# Altium schematic sheet E103-W02.SchDoc
size A2
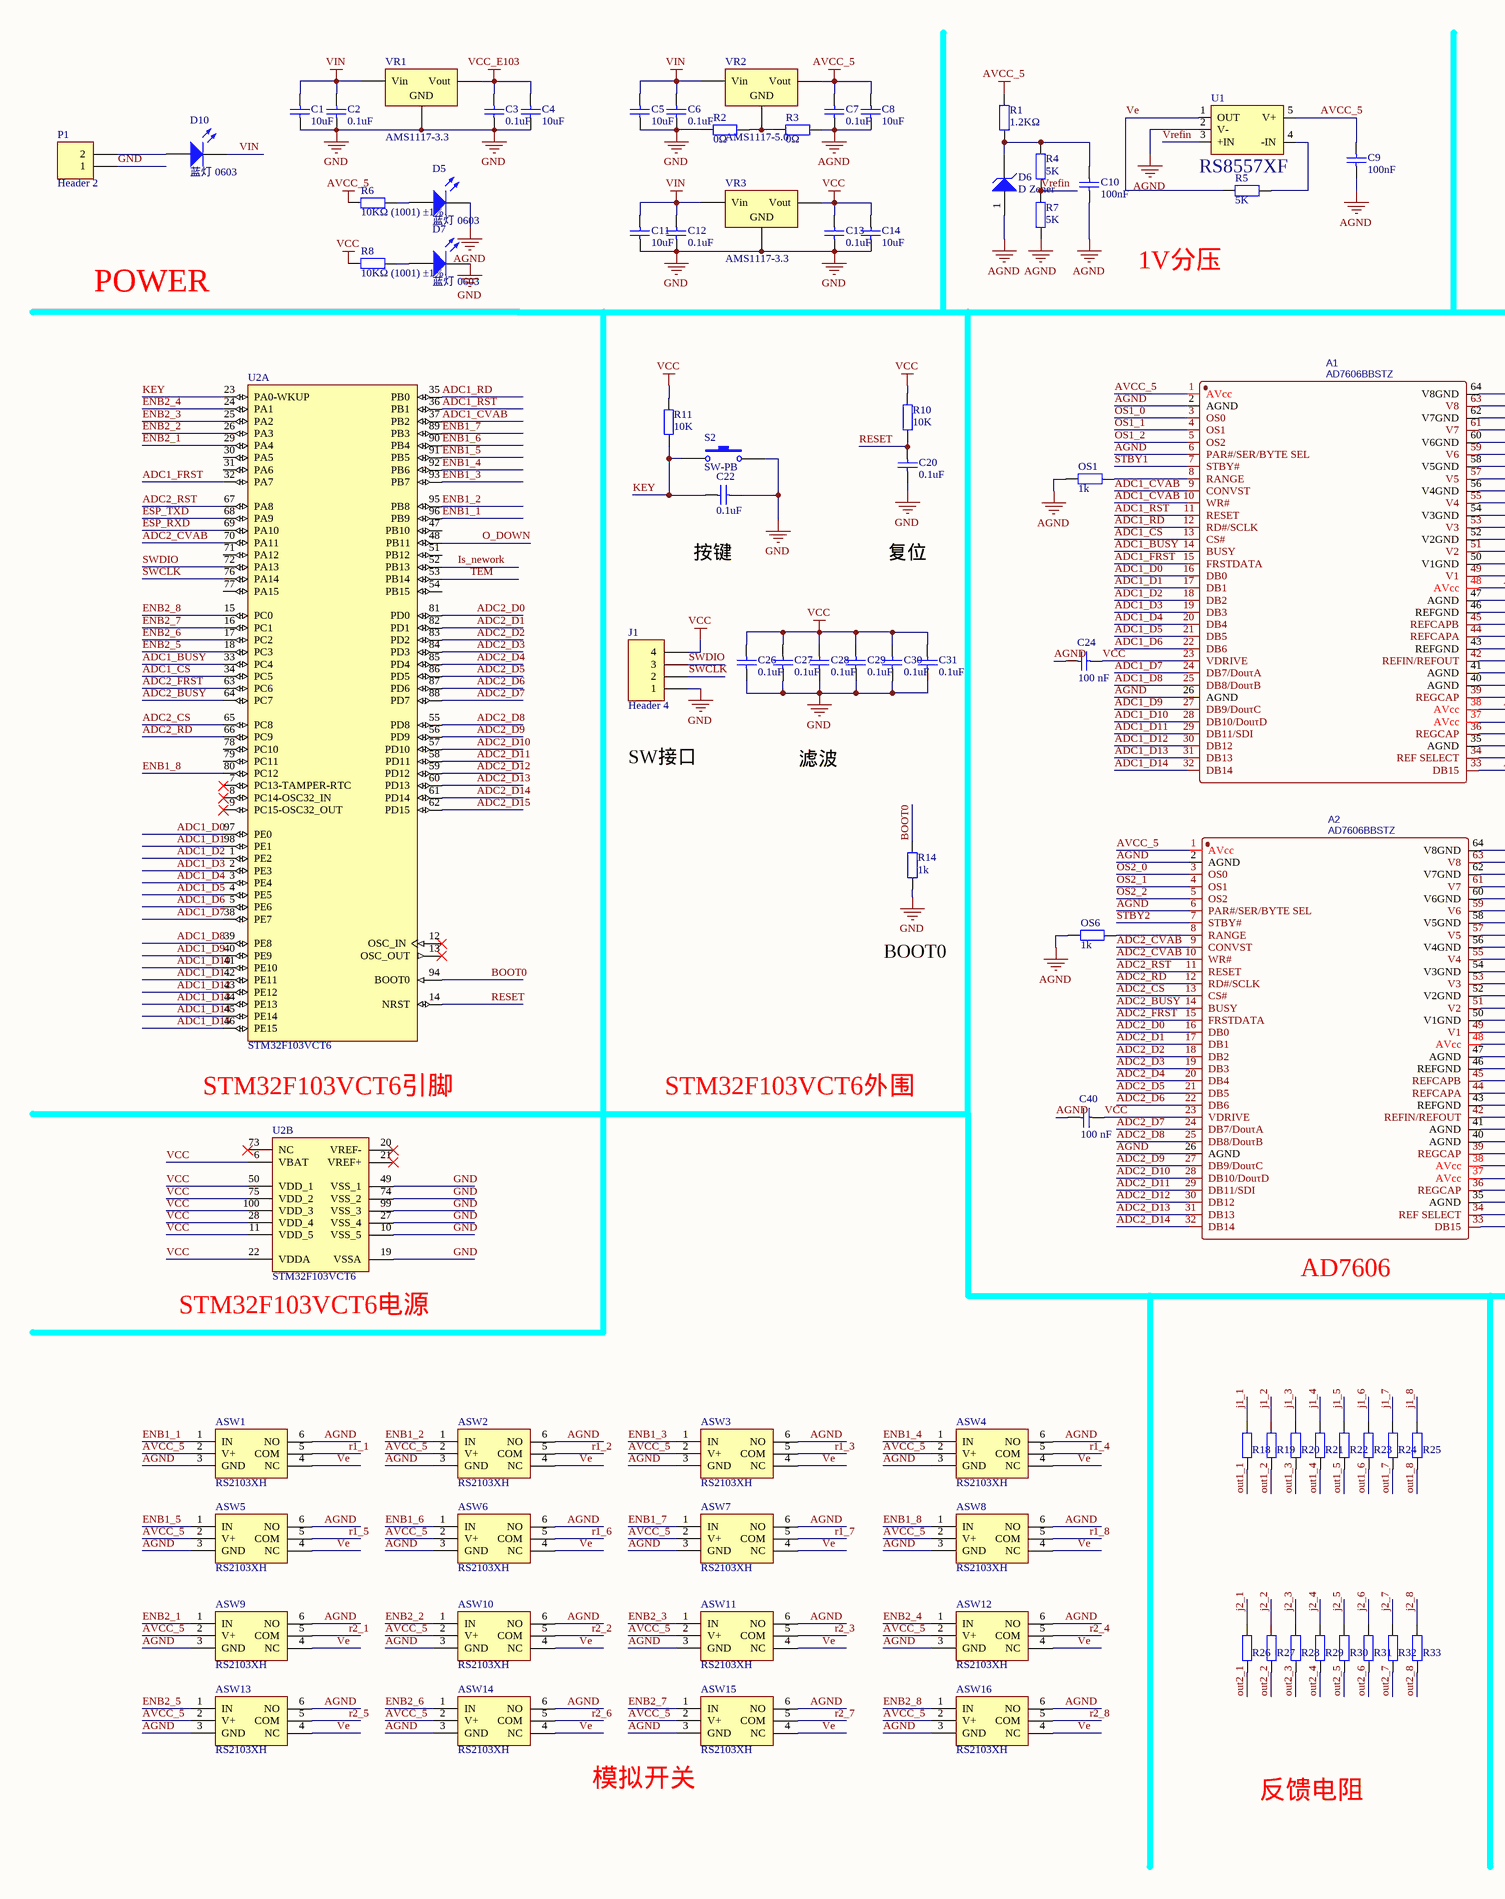
[diagram p0: E103-W02.SchDoc, left]
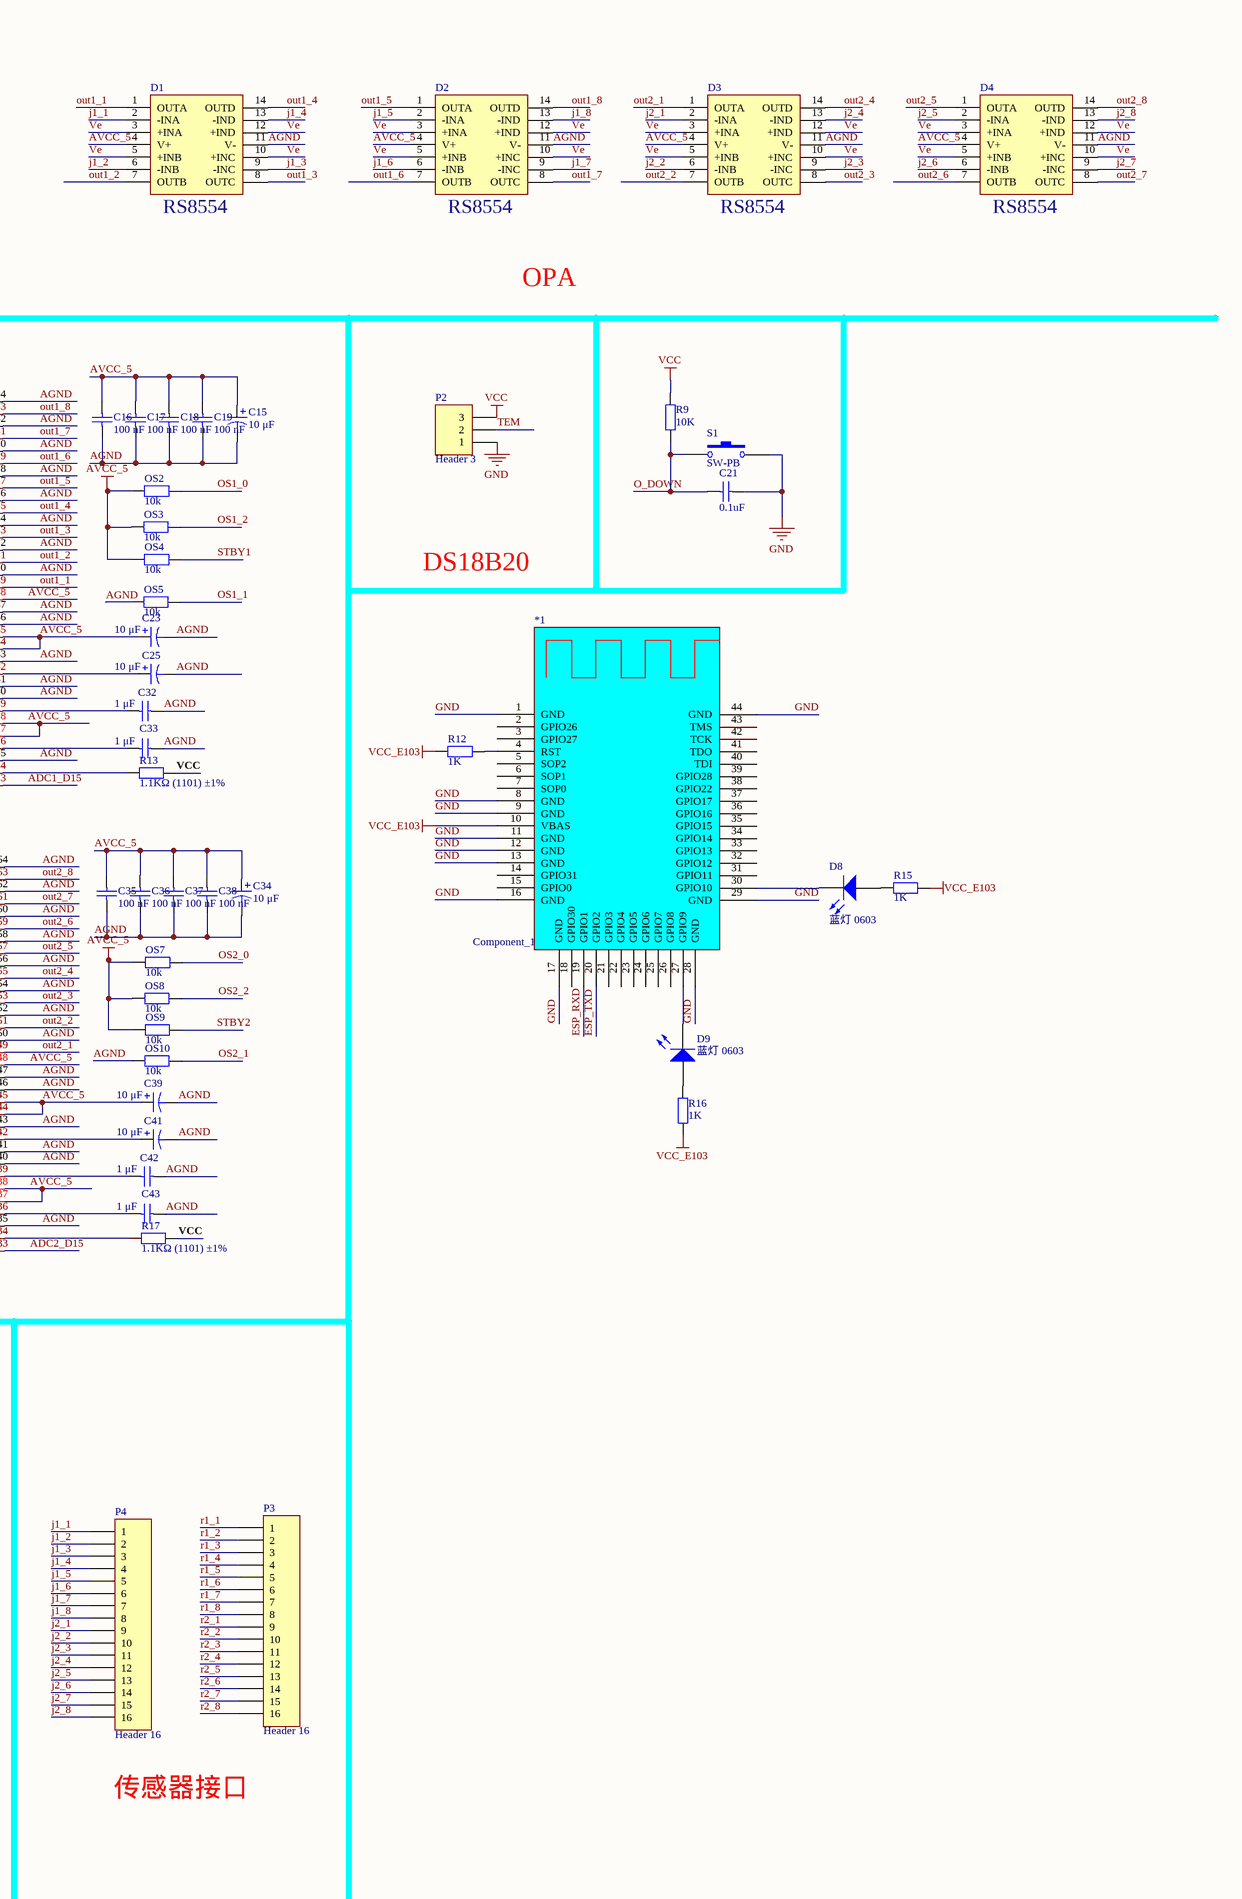
[diagram p1: E103-W02.SchDoc, right]

## Parts
*1  Component_1  [E103-W02]
A1  AD7606BBSTZ  [AD7606]
A2  AD7606BBSTZ  [AD7606]
ASW1  RS2103XH  [SOT-23-6]
ASW2  RS2103XH  [SOT-23-6]
ASW3  RS2103XH  [SOT-23-6]
ASW4  RS2103XH  [SOT-23-6]
ASW5  RS2103XH  [SOT-23-6]
ASW6  RS2103XH  [SOT-23-6]
ASW7  RS2103XH  [SOT-23-6]
ASW8  RS2103XH  [SOT-23-6]
ASW9  RS2103XH  [SOT-23-6]
ASW10  RS2103XH  [SOT-23-6]
ASW11  RS2103XH  [SOT-23-6]
ASW12  RS2103XH  [SOT-23-6]
ASW13  RS2103XH  [SOT-23-6]
ASW14  RS2103XH  [SOT-23-6]
ASW15  RS2103XH  [SOT-23-6]
ASW16  RS2103XH  [SOT-23-6]
C1  10uF  [0603_C]
C2  0.1uF  [0603_C]
C3  0.1uF  [0603_C]
C4  10uF  [0603_C]
C5  10uF  [0603_C]
C6  0.1uF  [0603_C]
C7  0.1uF  [0603_C]
C8  10uF  [0603_C]
C9  100nF  [0603_C]
C10  100nF  [0603_C]
C11  10uF  [0603_C]
C12  0.1uF  [0603_C]
C13  0.1uF  [0603_C]
C14  10uF  [0603_C]
C15  value 10 μF  [CASE-A_3216]  (hidden comment: Cap Pol3)
C16  100 nF  [0603_C]
C17  100 nF  [0603_C]
C18  100 nF  [0603_C]
C19  100 nF  [0603_C]
C20  0.1uF  [0603_C]
C21  0.1uF  [0603_C]
C22  0.1uF  [0603_C]
C23  value 10 μF  [CASE-A_3216]  (hidden comment: Cap Pol3)
C24  100 nF  [0603_C]
C25  value 10 μF  [CASE-A_3216]  (hidden comment: Cap Pol3)
C26  0.1uF  [0603_C]
C27  0.1uF  [0603_C]
C28  0.1uF  [0603_C]
C29  0.1uF  [0603_C]
C30  0.1uF  [0603_C]
C31  0.1uF  [0603_C]
C32  1 μF  [0603_C]
C33  1 μF  [0603_C]
C34  value 10 μF  [CASE-A_3216]  (hidden comment: Cap Pol3)
C35  100 nF  [0603_C]
C36  100 nF  [0603_C]
C37  100 nF  [0603_C]
C38  100 nF  [0603_C]
C39  value 10 μF  [CASE-A_3216]  (hidden comment: Cap Pol3)
C40  100 nF  [0603_C]
C41  value 10 μF  [CASE-A_3216]  (hidden comment: Cap Pol3)
C42  1 μF  [0603_C]
C43  1 μF  [0603_C]
D1  RS8554  [RS8554]
D2  RS8554  [RS8554]
D3  RS8554  [RS8554]
D4  RS8554  [RS8554]
D5  蓝灯 0603  [0603_LED_S1]
D6  D Zener  [SOT-23(SOT-23-3)]
D7  蓝灯 0603  [0603_LED_S1]
D8  蓝灯 0603  [0603_LED_S1]
D9  蓝灯 0603  [0603_LED_S1]
D10  蓝灯 0603  [标准DO-214AC]
J1  Header 4  [HDR1X4]
OS1  1k  [0603_C]
OS2  10k  [0603_C]
OS3  10k  [0603_C]
OS4  10k  [0603_C]
OS5  10k  [0603_C]
OS6  1k  [0603_C]
OS7  10k  [0603_C]
OS8  10k  [0603_C]
OS9  10k  [0603_C]
OS10  10k  [0603_C]
P1  Header 2  [HDR1X2]
P2  Header 3  [HDR1X3]
P3  Header 16  [FPC_16_0.5]
P4  Header 16  [FPC_16_0.5]
R1  1.2KΩ  [0603_R]
R2  0Ω  [0603_R]
R3  0Ω  [0603_R]
R4  5K  [0603_R]
R5  5K  [0603_R]
R6  10KΩ (1001) ±1%  [0603_R]
R7  5K  [0603_R]
R8  10KΩ (1001) ±1%  [0603_R]
R9  10K  [0603_R]
R10  10K  [0603_R]
R11  10K  [0603_R]
R12  1K  [0603_C]
R13  1.1KΩ (1101) ±1%  [0603_C]
R14  1k  [0603_R]
R15  1K  [0603_R]
R16  1K  [0603_R]
R17  1.1KΩ (1101) ±1%  [0603_C]
R18  100Ω  [0603_R]  (value not drawn)
R19  100Ω  [0603_R]  (value not drawn)
R20  100Ω  [0603_R]  (value not drawn)
R21  100Ω  [0603_R]  (value not drawn)
R22  100Ω  [0603_R]  (value not drawn)
R23  100Ω  [0603_R]  (value not drawn)
R24  100Ω  [0603_R]  (value not drawn)
R25  0KΩ  [0603_R]  (value not drawn)
R26  100Ω  [0603_R]  (value not drawn)
R27  100Ω  [0603_R]  (value not drawn)
R28  100Ω  [0603_R]  (value not drawn)
R29  100Ω  [0603_R]  (value not drawn)
R30  100Ω  [0603_R]  (value not drawn)
R31  100Ω  [0603_R]  (value not drawn)
R32  100Ω  [0603_R]  (value not drawn)
R33  0KΩ  [0603_R]  (value not drawn)
S1  SW-PB  [按键]
S2  SW-PB  [按键]
U1  RS8557XF  [SOT-23-5]
U2  STM32F103VCT6  [LQFP-100_14x14x05P]  (parts A,B of 2)
VR1  AMS1117-3.3  [SOT-223]
VR2  AMS1117-5.0  [SOT-223]
VR3  AMS1117-3.3  [SOT-223]

## Nets
AGND: A1.2(AGND) A1.6(PAR#/SER/BYTE_SEL) A1.26(AGND) A1.35(AGND) A1.40(AGND) A1.41(AGND) A1.43(REFGND) A1.46(REFGND) A1.47(AGND) A1.50(V1GND) A1.52(V2GND) A1.54(V3GND) A1.56(V4GND) A1.58(V5GND) A1.60(V6GND) A1.62(V7GND) A1.64(V8GND) A2.2(AGND) A2.6(PAR#/SER/BYTE_SEL) A2.26(AGND) A2.35(AGND) A2.40(AGND) A2.41(AGND) A2.43(REFGND) A2.46(REFGND) A2.47(AGND) A2.50(V1GND) A2.52(V2GND) A2.54(V3GND) A2.56(V4GND) A2.58(V5GND) A2.60(V6GND) A2.62(V7GND) A2.64(V8GND) ASW1.3(GND) ASW1.6(NO) ASW2.3(GND) ASW2.6(NO) ASW3.3(GND) ASW3.6(NO) ASW4.3(GND) ASW4.6(NO) ASW5.3(GND) ASW5.6(NO) ASW6.3(GND) ASW6.6(NO) ASW7.3(GND) ASW7.6(NO) ASW8.3(GND) ASW8.6(NO) ASW9.3(GND) ASW9.6(NO) ASW10.3(GND) ASW10.6(NO) ASW11.3(GND) ASW11.6(NO) ASW12.3(GND) ASW12.6(NO) ASW13.3(GND) ASW13.6(NO) ASW14.3(GND) ASW14.6(NO) ASW15.3(GND) ASW15.6(NO) ASW16.3(GND) ASW16.6(NO) C7.1 C8.1 C9.1 C10.1 C15.2 C16.1 C17.1 C18.1 C19.1 C23.2 C24.2 C25.2 C32.2 C33.2 C34.2 C35.1 C36.1 C37.1 C38.1 C39.2 C40.2 C41.2 C42.2 C43.2 D1.11(V-) D2.11(V-) D3.11(V-) D4.11(V-) D5.K D6.1(A) OS1.2 OS5.2 OS6.2 OS10.2 R3.2 R7.2 U1.2(V-)
AVCC_5: A1.1(AVcc) A1.37(AVcc) A1.38(AVcc) A1.44(REFCAPA) A1.45(REFCAPB) A1.48(AVcc) A2.1(AVcc) A2.37(AVcc) A2.38(AVcc) A2.44(REFCAPA) A2.45(REFCAPB) A2.48(AVcc) ASW1.2(V+) ASW2.2(V+) ASW3.2(V+) ASW4.2(V+) ASW5.2(V+) ASW6.2(V+) ASW7.2(V+) ASW8.2(V+) ASW9.2(V+) ASW10.2(V+) ASW11.2(V+) ASW12.2(V+) ASW13.2(V+) ASW14.2(V+) ASW15.2(V+) ASW16.2(V+) C7.2 C8.2 C9.2 C15.1 C16.2 C17.2 C18.2 C19.2 C23.1 C34.1 C35.2 C36.2 C37.2 C38.2 C39.1 D1.4(V+) D2.4(V+) D3.4(V+) D4.4(V+) OS2.2 OS3.2 OS4.2 OS7.2 OS8.2 OS9.2 R1.2 R6.1 U1.5(V+) VR2.2(Vout)
GND: *1.1(GND) *1.8(GND) *1.9(GND) *1.11(GND) *1.12(GND) *1.13(GND) *1.16(GND) *1.17(GND) *1.28(GND) *1.29(GND) *1.44(GND) C1.1 C2.1 C3.1 C4.1 C5.1 C6.1 C11.1 C12.1 C13.1 C14.1 C20.1 C21.1 C22.1 C26.1 C27.1 C28.1 C29.1 C30.1 C31.1 D7.K J1.1 P1.1 P2.1 R2.1 R14.1 S1.2 S2.2 U2.10(VSS_5) U2.19(VSSA) U2.27(VSS_4) U2.49(VSS_1) U2.74(VSS_2) U2.99(VSS_3) VR1.1(GND) VR3.1(GND)
VCC: A1.23(VDRIVE) A2.23(VDRIVE) C13.2 C14.2 C24.1 C26.2 C27.2 C28.2 C29.2 C30.2 C31.2 C40.1 J1.4 P2.3 R8.1 R9.2 R10.2 R11.2 R13.2 R17.2 U2.6(VBAT) U2.11(VDD_5) U2.22(VDDA) U2.28(VDD_4) U2.50(VDD_1) U2.75(VDD_2) U2.100(VDD_3) VR3.2(Vout)
VCC_E103: *1.10(VBAS) C3.2 C4.2 R12.1 R15.2 R16.1 VR1.2(Vout)
VIN: C1.2 C2.2 C5.2 C6.2 C11.2 C12.2 D10.K VR1.3(Vin) VR2.3(Vin) VR3.3(Vin)
ADC1_BUSY: A1.14(BUSY) U2.33(PC4)
ADC1_CS: A1.13(CS#) U2.34(PC5)
ADC1_CVAB: A1.9(CONVST) A1.10(WR#) U2.37(PB2)
ADC1_D0: A1.16(DB0) U2.97(PE0)
ADC1_D1: A1.17(DB1) U2.98(PE1)
ADC1_D2: A1.18(DB2) U2.1(PE2)
ADC1_D3: A1.19(DB3) U2.2(PE3)
ADC1_D4: A1.20(DB4) U2.3(PE4)
ADC1_D5: A1.21(DB5) U2.4(PE5)
ADC1_D6: A1.22(DB6) U2.5(PE6)
ADC1_D7: A1.24(DB7/DouτA) U2.38(PE7)
ADC1_D8: A1.25(DB8/DouτB) U2.39(PE8)
ADC1_D9: A1.27(DB9/DouτC) U2.40(PE9)
ADC1_D10: A1.28(DB10/DouτD) U2.41(PE10)
ADC1_D11: A1.29(DB11/SDI) U2.42(PE11)
ADC1_D12: A1.30(DB12) U2.43(PE12)
ADC1_D13: A1.31(DB13) U2.44(PE13)
ADC1_D14: A1.32(DB14) U2.45(PE14)
ADC1_D15: A1.33(DB15) U2.46(PE15)
ADC1_FRST: A1.15(FRSTDATA) U2.32(PA7)
ADC1_RD: A1.12(RD#/SCLK) U2.35(PB0)
ADC1_RST: A1.11(RESET) U2.36(PB1)
ADC2_BUSY: A2.14(BUSY) U2.64(PC7)
ADC2_CS: A2.13(CS#) U2.65(PC8)
ADC2_CVAB: A2.9(CONVST) A2.10(WR#) U2.70(PA11)
ADC2_D0: A2.16(DB0) U2.81(PD0)
ADC2_D1: A2.17(DB1) U2.82(PD1)
ADC2_D2: A2.18(DB2) U2.83(PD2)
ADC2_D3: A2.19(DB3) U2.84(PD3)
ADC2_D4: A2.20(DB4) U2.85(PD4)
ADC2_D5: A2.21(DB5) U2.86(PD5)
ADC2_D6: A2.22(DB6) U2.87(PD6)
ADC2_D7: A2.24(DB7/DouτA) U2.88(PD7)
ADC2_D8: A2.25(DB8/DouτB) U2.55(PD8)
ADC2_D9: A2.27(DB9/DouτC) U2.56(PD9)
ADC2_D10: A2.28(DB10/DouτD) U2.57(PD10)
ADC2_D11: A2.29(DB11/SDI) U2.58(PD11)
ADC2_D12: A2.30(DB12) U2.59(PD12)
ADC2_D13: A2.31(DB13) U2.60(PD13)
ADC2_D14: A2.32(DB14) U2.61(PD14)
ADC2_D15: A2.33(DB15) U2.62(PD15)
ADC2_FRST: A2.15(FRSTDATA) U2.63(PC6)
ADC2_RD: A2.12(RD#/SCLK) U2.66(PC9)
ADC2_RST: A2.11(RESET) U2.67(PA8)
BOOT0: R14.2 U2.94(BOOT0)
ENB1_1: ASW1.1(IN) U2.96(PB9)
ENB1_2: ASW2.1(IN) U2.95(PB8)
ENB1_3: ASW3.1(IN) U2.93(PB7)
ENB1_4: ASW4.1(IN) U2.92(PB6)
ENB1_5: ASW5.1(IN) U2.91(PB5)
ENB1_6: ASW6.1(IN) U2.90(PB4)
ENB1_7: ASW7.1(IN) U2.89(PB3)
ENB1_8: ASW8.1(IN) U2.80(PC12)
ENB2_1: ASW9.1(IN) U2.29(PA4)
ENB2_2: ASW10.1(IN) U2.26(PA3)
ENB2_3: ASW11.1(IN) U2.25(PA2)
ENB2_4: ASW12.1(IN) U2.24(PA1)
ENB2_5: ASW13.1(IN) U2.18(PC3)
ENB2_6: ASW14.1(IN) U2.17(PC2)
ENB2_7: ASW15.1(IN) U2.16(PC1)
ENB2_8: ASW16.1(IN) U2.15(PC0)
ESP_RXD: *1.19(GPIO1) U2.69(PA10)
ESP_TXD: *1.20(GPIO2) U2.68(PA9)
Is_nework: U2.52(PB13)
j1_1: D1.2(-INA) P4.1 R18.1
j1_2: D1.6(-INB) P4.2 R19.1
j1_3: D1.9(-INC) P4.3 R20.1
j1_4: D1.13(-IND) P4.4 R21.1
j1_5: D2.2(-INA) P4.5 R22.1
j1_6: D2.6(-INB) P4.6 R23.1
j1_7: D2.9(-INC) P4.7 R24.1
j1_8: D2.13(-IND) P4.8 R25.1
j2_1: D3.2(-INA) P4.9 R26.1
j2_2: D3.6(-INB) P4.10 R27.1
j2_3: D3.9(-INC) P4.11 R28.1
j2_4: D3.13(-IND) P4.12 R29.1
j2_5: D4.2(-INA) P4.13 R30.1
j2_6: D4.6(-INB) P4.14 R31.1
j2_7: D4.9(-INC) P4.15 R32.1
j2_8: D4.13(-IND) P4.16 R33.1
KEY: C22.2 R11.1 S2.1 U2.23(PA0-WKUP)
O_DOWN: C21.2 R9.1 S1.1 U2.48(PB11)
OS1_0: A1.3(OS0) OS2.1
OS1_1: A1.4(OS1) OS5.1
OS1_2: A1.5(OS2) OS3.1
OS2_0: A2.3(OS0) OS7.1
OS2_1: A2.4(OS1) OS10.1
OS2_2: A2.5(OS2) OS8.1
out1_1: A1.49(V1) D1.1(OUTA) R18.2
out1_2: A1.51(V2) D1.7(OUTB) R19.2
out1_3: A1.53(V3) D1.8(OUTC) R20.2
out1_4: A1.55(V4) D1.14(OUTD) R21.2
out1_5: A1.57(V5) D2.1(OUTA) R22.2
out1_6: A1.59(V6) D2.7(OUTB) R23.2
out1_7: A1.61(V7) D2.8(OUTC) R24.2
out1_8: A1.63(V8) D2.14(OUTD) R25.2
out2_1: A2.49(V1) D3.1(OUTA) R26.2
out2_2: A2.51(V2) D3.7(OUTB) R27.2
out2_3: A2.53(V3) D3.8(OUTC) R28.2
out2_4: A2.55(V4) D3.14(OUTD) R29.2
out2_5: A2.57(V5) D4.1(OUTA) R30.2
out2_6: A2.59(V6) D4.7(OUTB) R31.2
out2_7: A2.61(V7) D4.8(OUTC) R32.2
out2_8: A2.63(V8) D4.14(OUTD) R33.2
r1_1: ASW1.5(COM) P3.1
r1_2: ASW2.5(COM) P3.2
r1_3: ASW3.5(COM) P3.3
r1_4: ASW4.5(COM) P3.4
r1_5: ASW5.5(COM) P3.5
r1_6: ASW6.5(COM) P3.6
r1_7: ASW7.5(COM) P3.7
r1_8: ASW8.5(COM) P3.8
r2_1: ASW9.5(COM) P3.9
r2_2: ASW10.5(COM) P3.10
r2_3: ASW11.5(COM) P3.11
r2_4: ASW12.5(COM) P3.12
r2_5: ASW13.5(COM) P3.13
r2_6: ASW14.5(COM) P3.14
r2_7: ASW15.5(COM) P3.15
r2_8: ASW16.5(COM) P3.16
RESET: C20.2 R10.1 U2.14(NRST)
STBY1: A1.7(STBY#) OS4.1
STBY2: A2.7(STBY#) OS9.1
SWCLK: J1.2 U2.76(PA14)
SWDIO: J1.3 U2.72(PA13)
TEM: P2.2 U2.53(PB14)
Ve: ASW1.4(NC) ASW2.4(NC) ASW3.4(NC) ASW4.4(NC) ASW5.4(NC) ASW6.4(NC) ASW7.4(NC) ASW8.4(NC) ASW9.4(NC) ASW10.4(NC) ASW11.4(NC) ASW12.4(NC) ASW13.4(NC) ASW14.4(NC) ASW15.4(NC) ASW16.4(NC) D1.3(+INA) D1.5(+INB) D1.10(+INC) D1.12(+IND) D2.3(+INA) D2.5(+INB) D2.10(+INC) D2.12(+IND) D3.3(+INA) D3.5(+INB) D3.10(+INC) D3.12(+IND) D4.3(+INA) D4.5(+INB) D4.10(+INC) D4.12(+IND) R5.2 U1.1(OUT)
Vrefin: R4.1 R7.1 U1.3(+IN)
Net*1_4: *1.4(RST) R12.2
Net*1_27: *1.27(GPIO9) D9.K
Net*1_30: *1.30(GPIO10) D8.K
NetA1_8: A1.8(RANGE) OS1.1
NetA1_34: A1.34(REF_SELECT) R13.1
NetA1_36: A1.36(REGCAP) C33.1
NetA1_39: A1.39(REGCAP) C32.1
NetA1_42: A1.42(REFIN/REFOUT) C25.1
NetA2_8: A2.8(RANGE) OS6.1
NetA2_34: A2.34(REF_SELECT) R17.1
NetA2_36: A2.36(REGCAP) C43.1
NetA2_39: A2.39(REGCAP) C42.1
NetA2_42: A2.42(REFIN/REFOUT) C41.1
NetC10_2: C10.2 D6.2(K) R1.1 R4.2
NetD5_A: D5.A R6.2
NetD7_A: D7.A R8.2
NetD8_A: D8.A R15.1
NetD9_A: D9.A R16.2
NetD10_A: D10.A P1.2
NetR2_2: R2.2 R3.1 VR2.1(GND)
NetR5_1: R5.1 U1.4(-IN)

Not connected (* = marked no-connect by the designer): *1 2(GPIO26) 3(GPIO27) 5(SOP2) 6(SOP1) 7(SOP0) 14(GPIO31) 15(GPIO0) 18(GPIO30) 21(GPIO3) 22(GPIO4) 23(GPIO5) 24(GPIO6) 25(GPIO7) 26(GPIO8) 31(GPIO11) 32(GPIO12) 33(GPIO13) 34(GPIO14) 35(GPIO15) 36(GPIO16) 37(GPIO17) 38(GPIO22) 39(GPIO28) 40(TDI) 41(TDO) 42(TCK) 43(TMS); U2 7(PC13-TAMPER-RTC)* 8(PC14-OSC32_IN)* 9(PC15-OSC32_OUT)* 12(OSC_IN)* 13(OSC_OUT)* 20(VREF-)* 21(VREF+)* 30(PA5) 31(PA6) 47(PB10) 51(PB12) 54(PB15) 71(PA12) 73(NC)* 77(PA15) 78(PC10) 79(PC11)

## Notes on the sheet
- POWER
- 1V分压
- OPA
- 按键
- 复位
- DS18B20
- SW接口
- 滤波
- BOOT0
- (near U2) STM32F103VCT6引脚
- STM32F103VCT6外围
- (near U2) STM32F103VCT6电源
- (near A2) AD7606
- 模拟开关
- 反馈电阻
- 传感器接口

## Library data of the parts
A1 A2 = AD7606BBSTZ: BOM_Manufacturer: Analog Devices; Contributor: LCSC; BOM_Supplier: LCSC; BOM_Supplier Part: C443885; BOM_Manufacturer Part: AD7606BBSTZ; spicePre: U; spiceSymbolName: AD7606BBSTZ
C1-C8 C11-C14 = 0603 1.0pF (010) 0.25pF 50V: 贴片电容; ComponentLink1Description: 供应商链接; ComponentLink1URL: http://www.szlcsc.com/product/details_24709.html; Package: 0603; Supplier: LC; SuppliersPartNumber: C23969
C9 C10 C20-C22 = 0402 100nF (104) 10% 16V: 贴片电容; ComponentLink1Description: 供应商链接; ComponentLink1URL: http://www.szlcsc.com/product/details_1877.html; Package: 0402; Supplier: LC; SuppliersPartNumber: C1525
C15 C23 C25 C34 C39 C41 = Cap Pol3: Polarized Capacitor (Surface Mount); Published: 8-Jun-2000; LatestRevisionDate: 29-May-2009; LatestRevisionNote: IPC-7351 Footprint Added.; PackageReference: C0805; Publisher: Altium Limited; PackageDescription: Chip Capacitor
C16-C19 C24 C32 C33 C35-C38 C40 C42 C43 = 0603 1.5nF (152) 10% 50V: 贴片电容; ComponentLink1Description: 供应商链接; ComponentLink1URL: http://www.szlcsc.com/product/details_1947.html; Package: 0603; Supplier: LC; SuppliersPartNumber: C1595
C26-C31 = 0402 1.0uF (105) 10% 25V: 贴片电容; ComponentLink1Description: 供应商链接; ComponentLink1URL: http://www.szlcsc.com/product/details_53938.html; Package: 0402; Supplier: LC; SuppliersPartNumber: C52923
D1-D4 = 运放_OPA4374: 运放，4个集成IC，轨至轨，2.3-5.5V，SOIC-14和TSSOP-14封装
D5 D7-D10 = 0603 蓝灯: 发光二极管; ComponentLink1Description: 供应商链接; ComponentLink1URL: http://www.szlcsc.com/product/details_73150.html; Package: 0603; Supplier: LC; SuppliersPartNumber: C72041
D6 = D Zener: Zener Diode; pin to pad: 1>2 2>1; Published: 8-Jun-2000; LatestRevisionDate: 17-Jul-2002; LatestRevisionNote: Re-released for DXP Platform.; PackageReference: DIODE-0.7; Publisher: Altium Limited; PackageDescription: Diode, Thru-Hole; 2 Leads; 0.7 in Pin Spacing
J1 = Header 4: Header, 4-Pin; LatestRevisionDate: 17-Jul-2002; LatestRevisionNote: Re-released for DXP Platform.; Publisher: Altium Limited
OS1-OS10 = 0603 0Ω (0R0) 1%: 贴片电阻; ComponentLink1Description: 供应商链接; ComponentLink1URL: http://www.szlcsc.com/product/details_21903.html; Package: 0603; Supplier: LC; SuppliersPartNumber: C21189
P1 = Header 2: Header, 2-Pin; LatestRevisionDate: 17-Jul-2002; LatestRevisionNote: Re-released for DXP Platform.; Publisher: Altium Limited
P2 = Header 3: Header, 3-Pin; LatestRevisionDate: 17-Jul-2002; LatestRevisionNote: Re-released for DXP Platform.; Publisher: Altium Limited
P3 P4 = Header 16: Header, 16-Pin; LatestRevisionDate: 17-Jul-2002; LatestRevisionNote: Re-released for DXP Platform.; Publisher: Altium Limited
R1 = 0402 1.2KΩ (1201) 1%: 贴片电阻; ComponentLink1Description: 供应商链接; ComponentLink1URL: http://www.szlcsc.com/product/details_26605.html; Package: 0402; Supplier: LC; SuppliersPartNumber: C25862
R2 R3 = 1206 0Ω (0R0) 1%: 贴片电阻; ComponentLink1Description: 供应商链接; ComponentLink1URL: http://www.szlcsc.com/product/details_18576.html; Package: 1206; Supplier: LC; SuppliersPartNumber: C17888
R4 R5 R7 = 0603 100Ω (1000) 1%: 贴片电阻; ComponentLink1Description: 供应商链接; ComponentLink1URL: http://www.szlcsc.com/product/details_23502.html; Package: 0603; Supplier: LC; SuppliersPartNumber: C22775
R6 R8 = 0402 1KΩ (1001) 1%: 贴片电阻; ComponentLink1Description: 供应商链接; ComponentLink1URL: http://www.szlcsc.com/product/details_12256.html; Package: 0402; Supplier: LC; SuppliersPartNumber: C11702
R9-R11 R15 R16 = 0402 10KΩ (1002) 1%: 贴片电阻; ComponentLink1Description: 供应商链接; ComponentLink1URL: http://www.szlcsc.com/product/details_26487.html; Package: 0402; Supplier: LC; SuppliersPartNumber: C25744
R12 R13 R17 = 0603 1.1KΩ (1101) 1%: 贴片电阻; ComponentLink1Description: 供应商链接; ComponentLink1URL: http://www.szlcsc.com/product/details_23491.html; Package: 0603; Supplier: LC; SuppliersPartNumber: C22764
R14 = 0402 0Ω (0R0) 1%: 贴片电阻; ComponentLink1Description: 供应商链接; ComponentLink1URL: http://www.szlcsc.com/product/details_17853.html; Package: 0402; Supplier: LC; SuppliersPartNumber: C17168
R18-R33 = 0603 2KΩ (2001) 1%: 贴片电阻; ComponentLink1Description: 供应商链接; ComponentLink1URL: http://www.szlcsc.com/product/details_23702.html; Package: 0603; Supplier: LC; SuppliersPartNumber: C22975
S1 S2 = SW-PB: Switch; Published: 24-Mar-1999; LatestRevisionDate: 17-Jul-2002; LatestRevisionNote: Re-released for DXP Platform.; PackageReference: SPST-2; Publisher: Altium Limited; PackageDescription: Switch; 2 Leads
U2 = STM32F103VCT6: ARM; ComponentLink1Description: 供应商链接; ComponentLink1URL: http://www.szlcsc.com/product/details_8805.html; Package: LQFP-100_14x14x05P; Supplier: LC; SuppliersPartNumber: C8313
VR1-VR3 = SOT-223 AMS1117-3.3: 低压差线性稳压(LDO); ComponentLink1Description: 供应商链接; ComponentLink1URL: http://www.szlcsc.com/product/details_6652.html; Package: SOT-223; Supplier: LC; SuppliersPartNumber: C6186